# Altium schematic sheet S7CAS-PLEIADES-CARTE-MERE_P20_Ethernet.SchDoc
size Tabloid; DocumentNumber: 2; SheetNumber: 12; SheetTotal: 20; Sheet_Name: Ethernet; Size: 11x17
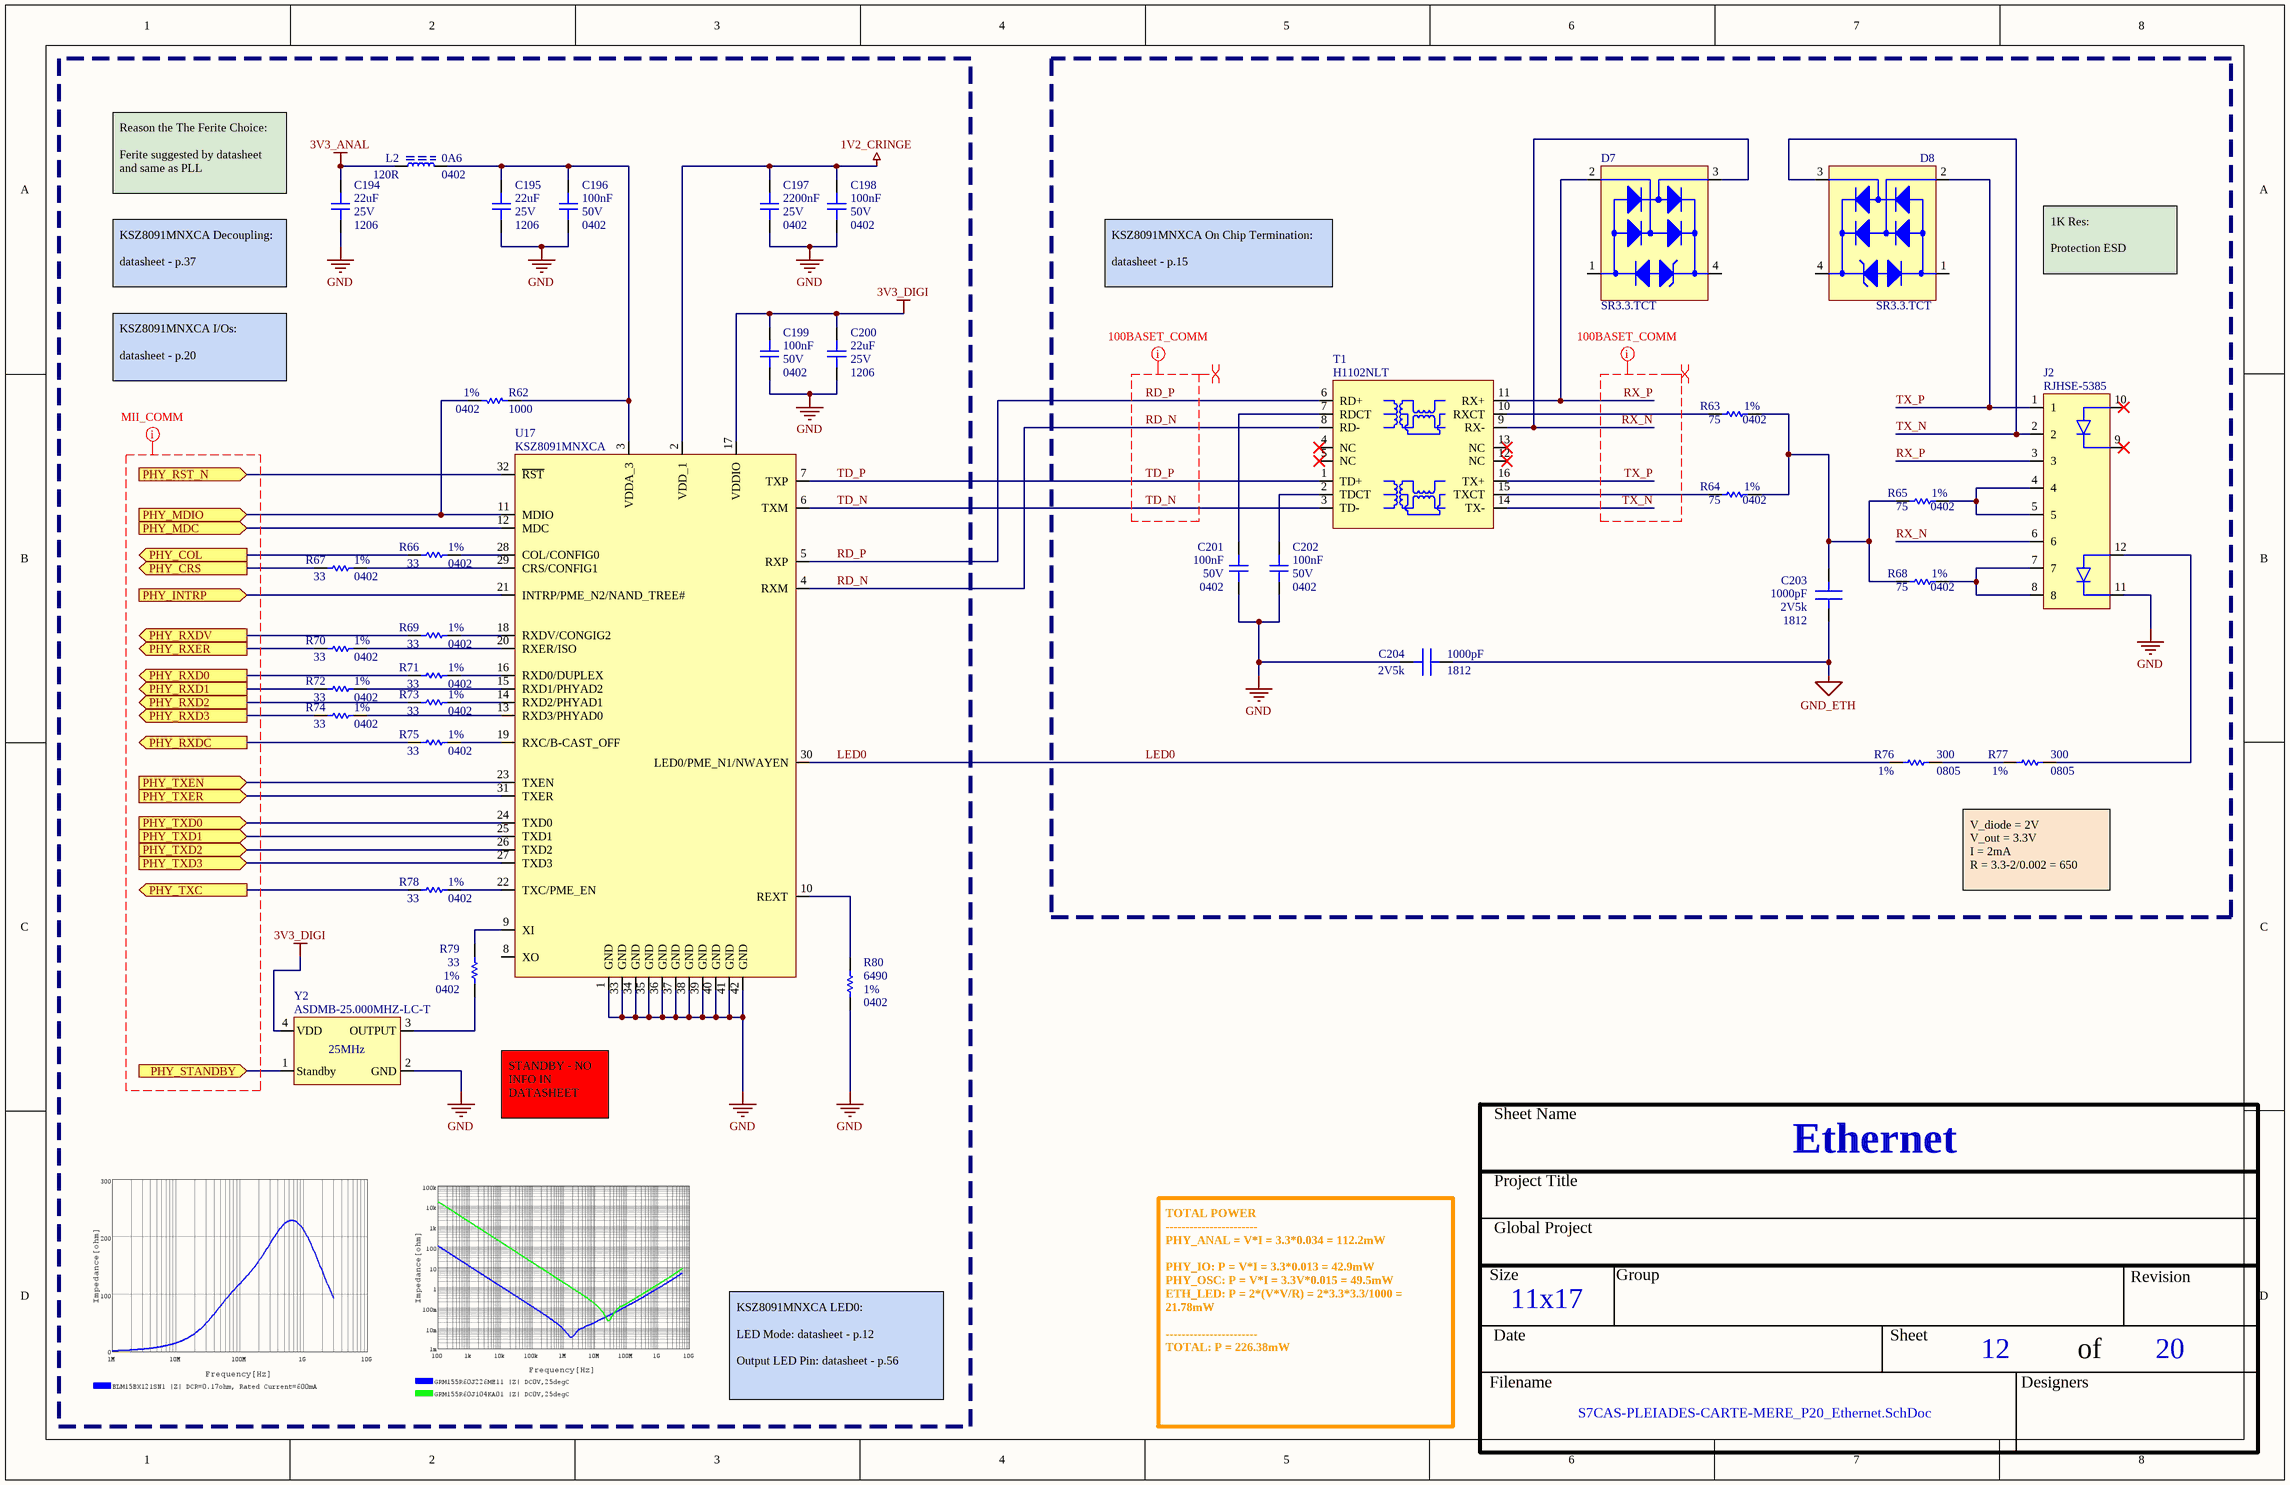
[diagram p0: S7CAS-PLEIADES-CARTE-MERE_P20_Ethernet.SchDoc]

## Parts
C194  value 22uF  Voltage: 25V  Package: 1206  [CAP_1206]  (hidden comment: CAP - 1206)
C195  value 22uF  Voltage: 25V  Package: 1206  [CAP_1206]  (hidden comment: CAP - 1206)
C196  value 100nF  Voltage: 50V  Package: 0402  [CAP_0402]  (hidden comment: CAP - 0402)
C197  value 2200nF  Voltage: 25V  Package: 0402  [CAP_0402]  (hidden comment: CAP - 0402)
C198  value 100nF  Voltage: 50V  Package: 0402  [CAP_0402]  (hidden comment: CAP - 0402)
C199  value 100nF  Voltage: 50V  Package: 0402  [CAP_0402]  (hidden comment: CAP - 0402)
C200  value 22uF  Voltage: 25V  Package: 1206  [CAP_1206]  (hidden comment: CAP - 1206)
C201  value 100nF  Voltage: 50V  Package: 0402  [CAP_0402]  (hidden comment: CAP - 0402)
C202  value 100nF  Voltage: 50V  Package: 0402  [CAP_0402]  (hidden comment: CAP - 0402)
C203  value 1000pF  Package: 1812  Voltage Rating: 2V5k  [CAP_CER_1812]  (hidden comment: 1812WC102KAT1A)
C204  value 1000pF  Package: 1812  Voltage Rating: 2V5k  [CAP_CER_1812]  (hidden comment: 1812WC102KAT1A)
D7  SR3.3.TCT  [TVS_SR3.3.TCT]
D8  SR3.3.TCT  [TVS_SR3.3.TCT]
J2  RJHSE-5385  [CONN_ETHERNET_RJHSE-5385]
L2  value 120R  Current: 0A6  Package: 0402  [FER_0402]  (hidden comment: FER - 0402)
R62  value 1000  Package: 0402  Precision: 1%  [RES_0402]  (hidden comment: RES - 0402)
R63  value 75  Package: 0402  Precision: 1%  [RES_0402]  (hidden comment: RES - 0402)
R64  value 75  Package: 0402  Precision: 1%  [RES_0402]  (hidden comment: RES - 0402)
R65  value 75  Package: 0402  Precision: 1%  [RES_0402]  (hidden comment: RES - 0402)
R66  value 33  Package: 0402  Precision: 1%  [RES_0402]  (hidden comment: RES - 0402)
R67  value 33  Package: 0402  Precision: 1%  [RES_0402]  (hidden comment: RES - 0402)
R68  value 75  Package: 0402  Precision: 1%  [RES_0402]  (hidden comment: RES - 0402)
R69  value 33  Package: 0402  Precision: 1%  [RES_0402]  (hidden comment: RES - 0402)
R70  value 33  Package: 0402  Precision: 1%  [RES_0402]  (hidden comment: RES - 0402)
R71  value 33  Package: 0402  Precision: 1%  [RES_0402]  (hidden comment: RES - 0402)
R72  value 33  Package: 0402  Precision: 1%  [RES_0402]  (hidden comment: RES - 0402)
R73  value 33  Package: 0402  Precision: 1%  [RES_0402]  (hidden comment: RES - 0402)
R74  value 33  Package: 0402  Precision: 1%  [RES_0402]  (hidden comment: RES - 0402)
R75  value 33  Package: 0402  Precision: 1%  [RES_0402]  (hidden comment: RES - 0402)
R76  value 300  Package: 0805  Precision: 1%  [RES_0805]  (hidden comment: RES - 0805)
R77  value 300  Package: 0805  Precision: 1%  [RES_0805]  (hidden comment: RES - 0805)
R78  value 33  Package: 0402  Precision: 1%  [RES_0402]  (hidden comment: RES - 0402)
R79  value 33  Package: 0402  Precision: 1%  [RES_0402]  (hidden comment: RES - 0402)
R80  value 6490  Package: 0402  Precision: 1%  [RES_0402]  (hidden comment: RES - 0402)
T1  H1102NLT  [TRANSFO_H1102NLT]
U17  KSZ8091MNXCA  [COM_ETH_PHY_KSZ8091MNXCA]
Y2  ASDMB-25.000MHZ-LC-T  [OSC_ASDMB-25.000MHZ-LC-T]

## Ports
PHY_COL (out), PHY_CRS (out), PHY_INTRP (in), PHY_MDC (in), PHY_MDIO (in), PHY_RST_N (in), PHY_RXD0 (out), PHY_RXD1 (out), PHY_RXD2 (out), PHY_RXD3 (out), PHY_RXDC (out), PHY_RXDV (out), PHY_RXER (out), PHY_STANDBY (in), PHY_TXC (out), PHY_TXD0 (in), PHY_TXD1 (in), PHY_TXD2 (in), PHY_TXD3 (in), PHY_TXEN (in), PHY_TXER (in)

## Nets
1V2_CRINGE: C197.2 C198.2 U17.2(VDD_1)
3V3_ANAL: C194.2 L2.2
3V3_DIGI: C199.2 C200.2 U17.17(VDDIO) Y2.4(VDD)
GND: C194.1 C195.1 C196.1 C197.1 C198.1 C199.1 C200.1 C201.1 C202.1 C204.2 J2.11(LED2_K) R80.1 U17.1(GND) U17.33(GND) U17.34(GND) U17.35(GND) U17.36(GND) U17.37(GND) U17.38(GND) U17.39(GND) U17.40(GND) U17.41(GND) U17.42(GND) Y2.2(GND)
GND_ETH: C203.2 C204.1
LED0: R76.2 U17.30(LED0/PME_N1/NWAYEN)
PHY_COL: R66.2 ; port PHY_COL
PHY_CRS: R67.2 ; port PHY_CRS
PHY_INTRP: U17.21(INTRP/PME_N2/NAND_TREE#) ; port PHY_INTRP
PHY_MDC: U17.12(MDC) ; port PHY_MDC
PHY_MDIO: R62.1 U17.11(MDIO) ; port PHY_MDIO
PHY_RST_N: U17.32(~{RST}) ; port PHY_RST_N
PHY_RXD0: R71.2 ; port PHY_RXD0
PHY_RXD1: R72.2 ; port PHY_RXD1
PHY_RXD2: R73.2 ; port PHY_RXD2
PHY_RXD3: R74.2 ; port PHY_RXD3
PHY_RXDC: R75.2 ; port PHY_RXDC
PHY_RXDV: R69.2 ; port PHY_RXDV
PHY_RXER: R70.2 ; port PHY_RXER
PHY_STANDBY: Y2.1(Standby) ; port PHY_STANDBY
PHY_TXC: R78.2 ; port PHY_TXC
PHY_TXD0: U17.24(TXD0) ; port PHY_TXD0
PHY_TXD1: U17.25(TXD1) ; port PHY_TXD1
PHY_TXD2: U17.26(TXD2) ; port PHY_TXD2
PHY_TXD3: U17.27(TXD3) ; port PHY_TXD3
PHY_TXEN: U17.23(TXEN) ; port PHY_TXEN
PHY_TXER: U17.31(TXER) ; port PHY_TXER
RD_N: T1.8(RD-) U17.4(RXM)
RD_P: T1.6(RD+) U17.5(RXP)
RX_N: D7.3 J2.6 T1.9(RX-)
RX_P: D7.2(VN) J2.3 T1.11(RX+)
TD_N: T1.3(TD-) U17.6(TXM)
TD_P: T1.1(TD+) U17.7(TXP)
TX_N: D8.3 J2.2 T1.14(TX-)
TX_P: D8.2(VN) J2.1 T1.16(TX+)
NetC195_2: C195.2 C196.2 L2.1 R62.2 U17.3(VDDA_3)
NetC201_2: C201.2 T1.7(RDCT)
NetC202_2: C202.2 T1.2(TDCT)
NetC203_1: C203.1 R63.1 R64.1 R65.2 R68.2
NetJ2_4: J2.4 J2.5 R65.1
NetJ2_7: J2.7 J2.8 R68.1
NetJ2_12: J2.12(LED2_A) R77.1
NetR63_2: R63.2 T1.10(RXCT)
NetR64_2: R64.2 T1.15(TXCT)
NetR66_1: R66.1 U17.28(COL/CONFIG0)
NetR67_1: R67.1 U17.29(CRS/CONFIG1)
NetR69_1: R69.1 U17.18(RXDV/CONGIG2)
NetR70_1: R70.1 U17.20(RXER/ISO)
NetR71_1: R71.1 U17.16(RXD0/DUPLEX)
NetR72_1: R72.1 U17.15(RXD1/PHYAD2)
NetR73_1: R73.1 U17.14(RXD2/PHYAD1)
NetR74_1: R74.1 U17.13(RXD3/PHYAD0)
NetR75_1: R75.1 U17.19(RXC/B-CAST_OFF)
NetR76_1: R76.1 R77.2
NetR78_1: R78.1 U17.22(TXC/PME_EN)
NetR79_1: R79.1 U17.9(XI)
NetR79_2: R79.2 Y2.3(OUTPUT)
NetR80_2: R80.2 U17.10(REXT)

Not connected (* = marked no-connect by the designer): D7 1(I/O) 4; D8 1(I/O) 4; J2 9(LED1_K)* 10(LED1_A)*; T1 4(NC)* 5(NC)* 12(NC)* 13(NC)*; U17 8(XO)

## Layout directives
net class MII_COMM; net class TRACKS_50: (no net found under the mark)
net class TRACKS_50: RD_N, RD_P, RX_N, RX_P, TD_N, TD_P, TX_N, TX_P
differential pair: RD_N, RD_P, RX_N, RX_P, TD_N, TD_P, TX_N, TX_P

## Notes on the sheet
- Reason the The Ferite Choice:
  Ferite suggested by datasheet and same as PLL
- KSZ8091MNXCA Decoupling:
  datasheet - p.37
- KSZ8091MNXCA On Chip Termination:
  datasheet - p.15
- 1K Res:
  Protection ESD
- KSZ8091MNXCA I/Os:
  datasheet - p.20
- V_diode = 2V
  V_out = 3.3V
  I = 2mA
  R = 3.3-2/0.002 = 650
- STANDBY - NO INFO IN DATASHEET
- KSZ8091MNXCA LED0:
  LED Mode: datasheet - p.12
  Output LED Pin: datasheet - p.56
- TOTAL POWER
  -----------------------
  PHY_ANAL = V*I = 3.3*0.034 = 112.2mW
  PHY_IO: P = V*I = 3.3*0.013 = 42.9mW
  PHY_OSC: P = V*I = 3.3V*0.015 = 49.5mW
  ETH_LED: P = 2*(V*V/R) = 2*3.3*3.3/1000 = 21.78mW
  -----------------------
  TOTAL: P = 226.38mW
- Sheet Name
- Project Title
- Global Project
- Size
- Group
- Revision
- Date
- Sheet
- of
- Filename
- Designers

## Library data of the parts
C194 C195 C200 = CAP - 1206: Mfg Part Number: GRM31CC81E226KE11; Precision: 10%; Current: *; HelpURL: https://search.murata.co.jp/Ceramy/image/img/A01X/G101/ENG/GRM31CD71H106KE11-01A.pdf; CreatedBy: Jonathan Bouchard; Power: *
C196 C198 C199 C201 C202 = CAP - 0402: Mfg Part Number: GRM155R61H104KE14; Precision: 10%; Current: *; CreatedBy: Jonathan Bouchard; Power: *
C197 = CAP - 0402: Mfg Part Number: GRM155R61E225KE11; Precision: 10%; Current: *; CreatedBy: Jonathan Bouchard; Power: *
C203 C204 = CAP_CER_1812WC102KAT1A: CAP - CER 1000PF 2.5KV X7R - 1812; Tolerance: 10%; GRAMS Lib Spec: 2.7; Temperature: -55 to 125C
D7 D8 = TVS_SR3.3.TCT: TVS - DIODE ARRAY 3.3V 150W - SOT143-4; Mfg: Semtech; Voltage: VBR=3.3V; Current: *; Mfg Part Number: SR3.3.TCT; HelpURL: http://www.semtech.com/images/datasheet/sr3.3.pdf; CreatedBy: Jonathan Bouchard; Temperature: -55°C to 125°C; Power: 150W; Package: SOT143-4; Precision: *; Value: *; Supplier 1: Digikey; Supplier Part Number 1: SR3.3DKR-ND
J2 = CONN_ETHERNET_RJHSE-5385: CONN - MOD JACK RJ45 R/A ETHERNET - TH; Mfg: Amphenol; Voltage: *; Current: *; Power: *; Mfg Part Number: RJHSE-5385; HelpURL: https://www.amphenolcanada.com/ProductSearch/drawings/AC/RJHSE538X.pdf; CreatedBy: Jonathan Bouchard; Temperature: -55°C ~ 85°C; Value: *; Precision: *; Package: TH-12; Supplier 1: Digikey; Supplier Part Number 1: RJHSE-5385-ND
L2 = FER - 0402: Mfg Part Number: BLM15BX121SN1; Voltage: *; CreatedBy: Jonathan Bouchard; Power: *; Precision: *
R62 = RES - 0402: Mfg Part Number: MCS04020C1001FE000; Voltage: 50V; Power: 1/16W; Current: *; CreatedBy: Jonathan Bouchard
R63-R65 R68 = RES - 0402: Mfg Part Number: SG73P; Voltage: 50V; Power: 1/16W; Current: *; CreatedBy: Jonathan Bouchard
R66 R67 R69-R75 R78 R79 = RES - 0402: Mfg Part Number: CRCW040233R0FKEDC; Voltage: 50V; Power: 1/16W; Current: *; CreatedBy: Jonathan Bouchard
R76 R77 = RES - 0805: Mfg Part Number: CRM0805-FX-1000ELF; Current: *; CreatedBy: Jonathan Bouchard
R80 = RES - 0402: Mfg Part Number: CRCW04026K49FKEDC; Voltage: 50V; Power: 1/16W; Current: *; CreatedBy: Jonathan Bouchard
T1 = TRANSFO_H1102NLT: TRANSFO - ETHERNET 10/100B-TX - SMD-16; Mfg: Pulse Eng.; Value: 1:1 (350uH); Voltage: *; Current: *; Power: *; Mfg Part Number: H1102NLT; HelpURL: http://media.digikey.com/pdf/Data%20Sheets/Pulse%20PDFs/10_100BASE-T%20Single%20Port%20SMD%20Magnetics_Rev2008.pdf; CreatedBy: Jonathan Bouchard; Temperature: -40°C to 85°C; Precision: *; Package: SMD-16; Supplier 1: Digikey; Supplier Part Number 1: 553-1532-1-ND
U17 = COM_ETH_PHY_KSZ8091MNXCA: COM - ETHERNET PHY 10/100 - QFN-32; Voltage: 1.8V, 2.5V, 3.3V; Mfg: Micrel; Current: *; Power: *; Mfg Part Number: KSZ8091MNXCA; HelpURL: http://ww1.microchip.com/downloads/en/DeviceDoc/00002275A.pdf; CreatedBy: Jonathan Bouchard; Temperature: 0°C ~ 70°C; Value: *; Precision: *; Package: QFN-32; Supplier 1: Digikey; Supplier Part Number 1: 576-4356-ND
Y2 = OSC_ASDMB-25.000MHZ-LC-T: OSC - 25MHz XO (Standard) LVCMOS - 4-SMD, No Lead; Manufacturer #1: Abracon LLC; Tolerance: ±50ppm; Voltage Rating: 1.8V ~ 3.3V; GRAMS Lib Spec: 2.8; Magnetic Material: Unknown; Polarized: Yes; Value: 25MHz; Current Rating: *; Power Max: *; HelpURL: https://abracon.com/Oscillators/ASDMB.pdf; CreatedBy/Date: Joël Lemay 2019-03-29; VerifiedBy: C. Paulin - 29 mai 2019; Temperature: -40°C ~ +85°C; Package: 4-SMD, No Lead; Manufacturer #2: *; Note: *; Assembly Type: SMD; Part Number #2: *; Part Number #1: ASDMB-25.000MHZ-LC-T; Supplier 1: Digi-Key; Supplier Part Number 1: 535-11730-1-ND; Cryo: UNKNOWN; Mfg PArt Number: ASDMB-25.000MHZ-LC-T